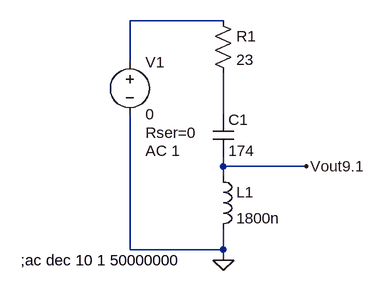
[diagram p0: schematic 9_1MHzBPNoise.asc]
9_1MHzBPNoise.asc, the LTspice schematic file:
Version 4
SHEET 1 880 680
WIRE 32 48 -112 48
WIRE -112 112 -112 48
WIRE 32 192 32 128
WIRE 32 272 32 256
WIRE 160 272 32 272
WIRE 32 288 32 272
WIRE -112 400 -112 192
WIRE 32 400 32 368
WIRE 32 400 -112 400
WIRE 32 416 32 400
FLAG 32 416 0
FLAG 160 272 Vout9.1
SYMBOL res 16 32 R0
SYMATTR InstName R1
SYMATTR Value 23
SYMBOL voltage -112 96 R0
WINDOW 123 24 152 Left 2
WINDOW 39 24 124 Left 2
SYMATTR Value2 AC 1
SYMATTR SpiceLine Rser=0
SYMATTR InstName V1
SYMATTR Value 0
SYMBOL cap 16 192 R0
SYMATTR InstName C1
SYMATTR Value 174
SYMBOL ind 16 272 R0
SYMATTR InstName L1
SYMATTR Value 1800n
SYMATTR SpiceLine Rser=2.6
TEXT -280 416 Left 2 !;ac dec 10 1 50000000

The netlist it stands for:
* 9_1MHzBPNoise.asc
R1 N001 N002 23
V1 N001 0 0 AC 1 Rser=0
C1 N002 Vout9.1 174
L1 Vout9.1 0 1800n Rser=2.6
;ac dec 10 1 50000000
.backanno
.end